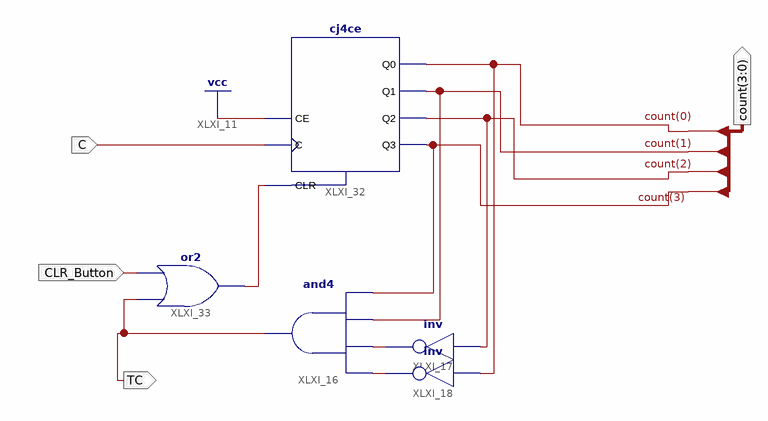
[diagram p0: schematic sheet 1]
// Xilinx ISE schematic counter0_9.sch (spartan6) as structural Verilog: 5 symbols, 4 ports
module counter0_9 (
  input  C,
  input  CLR_Button,
  output TC,
  output [3:0] count
);

  wire XLXN_20, XLXN_21;

  not XLXI_17 (XLXN_20, count[2]);
  not XLXI_18 (XLXN_21, count[0]);
  and XLXI_16 (TC, count[3], count[1], XLXN_20, XLXN_21);
  cj4ce XLXI_32 (.C(C), .CE(1'b1), .CLR(TC), .Q0(count[0]), .Q1(count[1]), .Q2(count[2]), .Q3(count[3]));
  or XLXI_33 (TC, TC, CLR_Button);
endmodule
